# EAGLE schematic STML451RE (EAGLE 9.6.2)

## Sheet 1 of 2
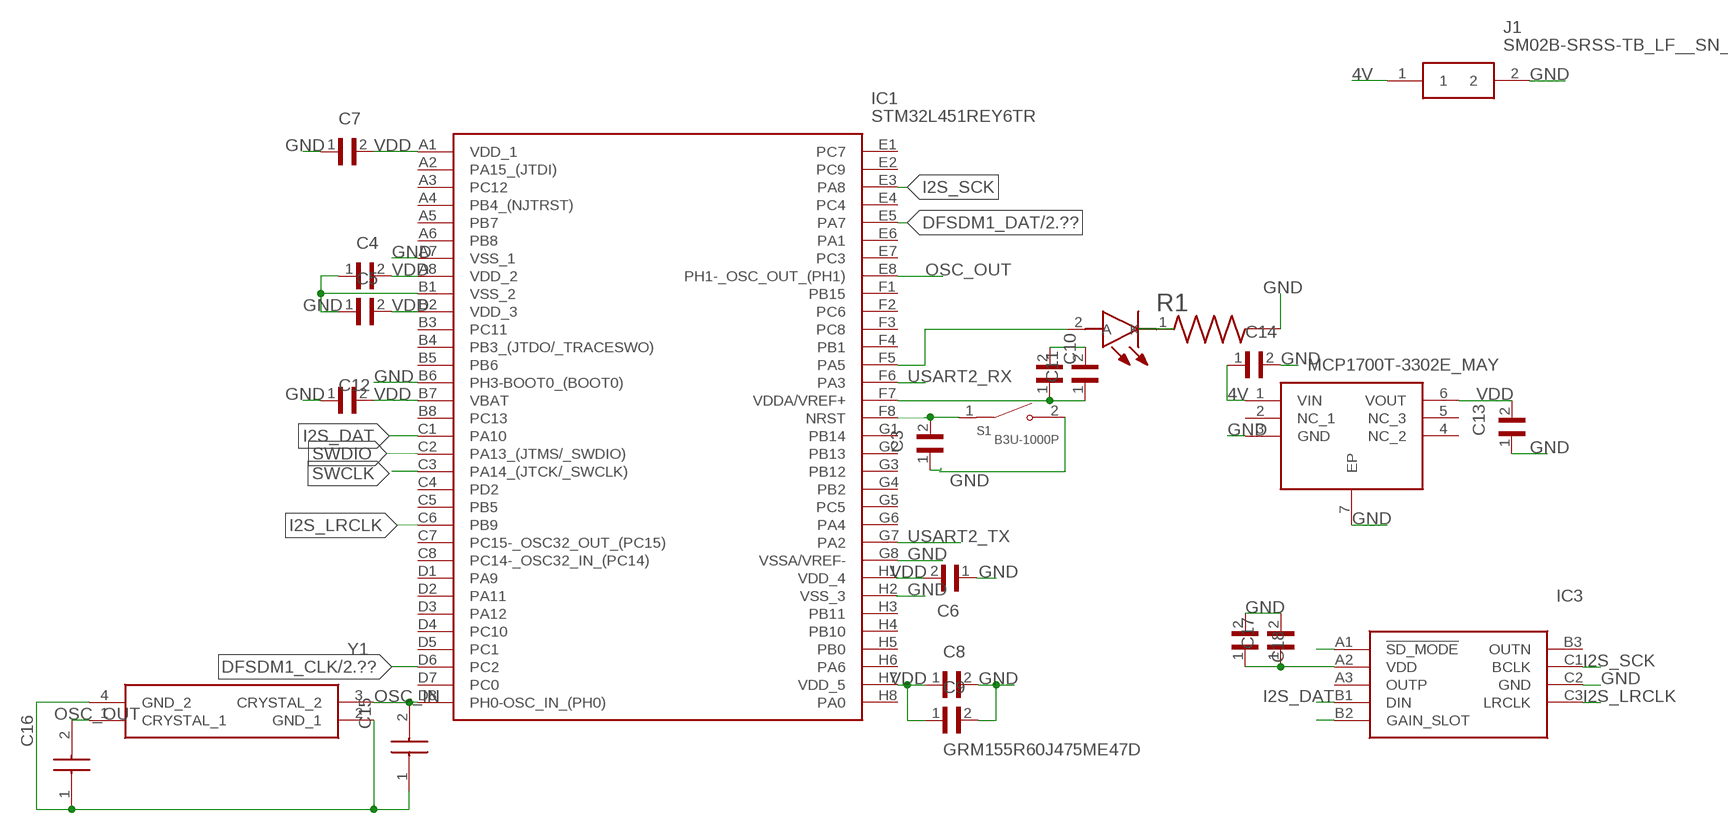
[diagram p0: schematic, sheet 1]

### Parts
C3  GRM033C80J104KE15D  [CAPC0603X33N]
C4  GRM033C80J104KE15D  [CAPC0603X33N]
C5  GRM033C80J104KE15D  [CAPC0603X33N]
C6  GRM033C80J104KE15D  [CAPC0603X33N]
C7  GRM033C80J104KE15D  [CAPC0603X33N]
C8  GRM033C80J104KE15D  [CAPC0603X33N]
C9  GRM155R60J475ME47D  [CAPC1005X60N]
C10  GRM033C80J104KE15D  [CAPC0603X33N]
C11  JMK105C6105KV-F  [CAPC1005X55N]
C12  GRM033C80J104KE15D  [CAPC0603X33N]
C13  JMK105C6105KV-F  [CAPC1005X55N]
C14  JMK105C6105KV-F  [CAPC1005X55N]
C15  0101YA120JAT2A  [CAPC0402X22N]
C16  0101YA120JAT2A  [CAPC0402X22N]
C17  GRM033C80J104KE15D  [CAPC0603X33N]
C18  C0805C106K8PACTU  [CAPC2012X88N]
IC1  STM32L451REY6TR  [BGA64C40P8X8_336X366X58]
IC2  MCP1700T-3302E_MAY  [SON65P200X200X90-7N]
IC3  MAX98357AEWL+T  [BGA9C40P3X3_144X135X69]
J1  SM02B-SRSS-TB_LF__SN_  [SM02B-SRSS-TB]
LED1  VLMS1500-GS08  [VLMG1500GS08]
R1  CRCW02012K20FKED  [RESC0603X28N]
S1  B3U-1000P  [SW_B3U-1000P]
Y1  FL0800008Q  [FL0800008Q]

### Nets
4V: C14.1 IC2.1(VIN) J1.1
DFSDM1_CLK: IC1.D6(PC2) ; also sheet 2
DFSDM1_DAT: IC1.E5(PA7) ; also sheet 2
GND: C3.1 C4.1 C5.1 C6.1 C7.1 C8.2 C9.2 C12.1 C13.1 C14.2 C15.1 C16.1 C17.2 C18.2 IC1.A7(VSS_1) IC1.B1(VSS_2) IC1.B6(PH3-BOOT0_(BOOT0)) IC1.G8(VSSA/VREF-) IC1.H2(VSS_3) IC2.3(GND) IC2.7(EP) IC3.C2(GND) J1.2 R1.2 Y1.2(GND_1) Y1.4(GND_2) ; also sheet 2
I2S_DAT: IC1.C1(PA10) IC3.B1(DIN)
I2S_LRCLK: IC1.C6(PB9) IC3.C3(LRCLK)
I2S_SCK: IC1.E3(PA8) IC3.C1(BCLK)
N$1: IC1.F5(PA5) LED1.2(A)
N$3: IC1.F8(NRST)
N$4: C3.2 S1.1
N$5: S1.2
N$6: C10.1 C11.1 IC1.F7(VDDA/VREF+)
N$7: C10.2 C11.2
N$8: LED1.1(K) R1.1
N$9: C17.1 C18.1 IC3.A2(VDD)
N$13: IC3.B2(GAIN_SLOT)
N$15: IC3.A1(!SD_MODE)
OSC_IN: C15.2 IC1.D8(PH0-OSC_IN_(PH0)) Y1.3(CRYSTAL_2)
OSC_OUT: C16.2 IC1.E8(PH1-_OSC_OUT_(PH1)) Y1.1(CRYSTAL_1)
SWCLK: IC1.C3(PA14_(JTCK/_SWCLK))
SWDIO: IC1.C2(PA13_(JTMS/_SWDIO))
USART2_RX: IC1.F6(PA3)
USART2_TX: IC1.G7(PA2)
VDD: C4.2 C5.2 C6.2 C7.2 C8.1 C9.1 C12.2 C13.2 IC1.A1(VDD_1) IC1.A8(VDD_2) IC1.B2(VDD_3) IC1.B7(VBAT) IC1.H1(VDD_4) IC1.H7(VDD_5) IC2.6(VOUT) ; also sheet 2
Unconnected: IC1.A2(PA15_(JTDI)) IC1.A3(PC12) IC1.A4(PB4_(NJTRST)) IC1.A5(PB7) IC1.A6(PB8) IC1.B3(PC11) IC1.B4(PB3_(JTDO/_TRACESWO)) IC1.B5(PB6) IC1.B8(PC13) IC1.C4(PD2) IC1.C5(PB5) IC1.C7(PC15-_OSC32_OUT_(PC15)) IC1.C8(PC14-_OSC32_IN_(PC14)) IC1.D1(PA9) IC1.D2(PA11) IC1.D3(PA12) IC1.D4(PC10) IC1.D5(PC1) IC1.D7(PC0) IC1.E1(PC7) IC1.E2(PC9) IC1.E4(PC4) IC1.E6(PA1) IC1.E7(PC3) IC1.F1(PB15) IC1.F2(PC6) IC1.F3(PC8) IC1.F4(PB1) IC1.G1(PB14) IC1.G2(PB13) IC1.G3(PB12) IC1.G4(PB2) IC1.G5(PC5) IC1.G6(PA4) IC1.H3(PB11) IC1.H4(PB10) IC1.H5(PB0) IC1.H6(PA6) IC1.H8(PA0) IC2.2(NC_1) IC2.4(NC_2) IC2.5(NC_3) IC3.A3(OUTP) IC3.B3(OUTN)

## Sheet 2 of 2
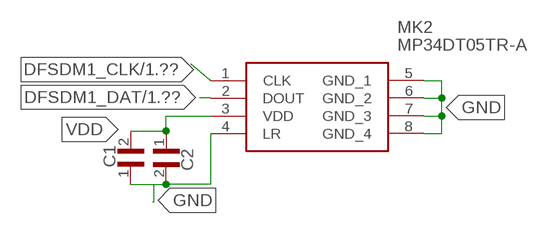
[diagram p1: schematic, sheet 2]

### Parts
C1  GRM033C80J104KE15D  [CAPC0603X33N]
C2  JMK105C6105KV-F  [CAPC1005X55N]
MK2  MP34DT05TR-A  [MP34DT05TRA]

### Nets
DFSDM1_CLK: MK2.1(CLK) ; also sheet 1
DFSDM1_DAT: MK2.2(DOUT) ; also sheet 1
GND: MK2.5(GND_1) MK2.6(GND_2) MK2.7(GND_3) MK2.8(GND_4) ; also sheet 1
N$2: C1.1 C2.2 MK2.4(LR)
VDD: C1.2 C2.1 MK2.3(VDD) ; also sheet 1

## Library data of the parts
C1 C3-C8 C10 C12 C17 = GRM033C80J104KE15D:GRM033C80J104KE15D: .1UF 6.3V 10% 0201; DESCRIPTION: SMD Capacitor X6S(EIA) with Capacitance: 0.10uF Tol. 10%. Rated Voltage: 6.3Vdc; DIGI-KEY_PART_NUMBER: 490-10390-1-ND; DIGIKEY-PURCHASE-URL: https://snapeda.com/shop?store=DigiKey&id=1836969; MF: Murata Electronics; MP: GRM033C80J104KE15D; PACKAGE: 0603 Taiyo Yuden
C2 C11 C13 C14 = JMK105C6105KV-F:JMK105C6105KV-F: CAP CER 1UF 6.3V X6S 0402; DESCRIPTION: 1µF ±10% 6.3V Ceramic Capacitor X6S 0402 (1005 Metric); DIGI-KEY_PART_NUMBER: 587-3381-1-ND; MF: Taiyo Yuden; MP: JMK105C6105KV-F; PACKAGE: 1005 Taiyo Yuden
C9 = GRM155R60J475ME47D:GRM155R60J475ME47D: Cap Ceramic 4.7uF 6.3V X5R 20% Pad SMD 0402 85°C T/R; DESCRIPTION: SMD Capacitor X5R(EIA) with Capacitance: 4.7uF Tol. 20%. Rated Voltage: 6.3Vdc; DIGI-KEY_PART_NUMBER: 490-5915-1-ND; MF: Murata; MP: GRM155R60J475ME47D; PACKAGE: 1005 Taiyo Yuden
C15 C16 = 0101YA120JAT2A:0101YA120JAT2A: Multilayer Ceramic Capacitors MLCC - SMD/SMT 16V 12pF C0G 0101 5% Source: Datasheet <https://componentsearchengine.com/Datasheets/1/0101YA120JAT2A.pdf>; ARROW_PART_NUMBER: 0101YA120JAT2A; DESCRIPTION: Multilayer Ceramic Capacitors MLCC - SMD/SMT 16V 12pF C0G 0101 5%; HEIGHT: 0.22mm; MANUFACTURER_NAME: AVX; MANUFACTURER_PART_NUMBER: 0101YA120JAT2A; MOUSER_PART_NUMBER: 581-0101YA120JAT2A; MOUSER_PRICE-STOCK: https://www.mouser.co.uk/ProductDetail/AVX/0101YA120JAT2A?qs=%2FqkzDQqtunKwlmb2lfYspQ%3D%3D
C18 = C0805C106K8PACTU:C0805C106K8PACTU; DESCRIPTION: 10µF ±10% 10V Ceramic Capacitor X5R 0805 (2012 Metric); MF: KEMET; MP: C0805C106K8PACTU; PACKAGE: 0805 KEMET
IC1 = STM32L451REY6TR:STM32L451REY6TR: ARM Microcontrollers - MCU 16/32-BITS MICROS Source: Datasheet <http://www.st.com/content/ccc/resource/technical/document/datasheet/group3/95/fa/32/09/46/cb/45/35/DM00340475/files/DM00340475.pdf/jcr:content/translations/en.DM00340475.pdf>; DESCRIPTION: ARM Microcontrollers - MCU 16/32-BITS MICROS; HEIGHT: 0.585mm; MANUFACTURER_NAME: STMicroelectronics; MANUFACTURER_PART_NUMBER: STM32L451REY6TR; MOUSER_PART_NUMBER: 511-STM32L451REY6TR; MOUSER_PRICE-STOCK: https://www.mouser.co.uk/ProductDetail/STMicroelectronics/STM32L451REY6TR?qs=Mv7BduZupUg2YTQ5MbUYvA%3D%3D
IC2 = MCP1700T-3302E_MAY:MCP1700T-3302E_MAY: LDO Regulator Pos 3.3V 0.25A Automotive 6-Pin DFN EP T/R Source: Datasheet <http://ww1.microchip.com/downloads/en/DeviceDoc/20001826D.pdf>; ARROW_PART_NUMBER: MCP1700T-3302E/MAY; ARROW_PRICE-STOCK: https://www.arrow.com/en/products/mcp1700t-3302emay/microchip-technology; DESCRIPTION: LDO Regulator Pos 3.3V 0.25A Automotive 6-Pin DFN EP T/R; HEIGHT: 0.9mm; MANUFACTURER_NAME: Microchip; MANUFACTURER_PART_NUMBER: MCP1700T-3302E/MAY; MOUSER_PART_NUMBER: 579-MCP1700T3302EMAY; MOUSER_PRICE-STOCK: https://www.mouser.co.uk/ProductDetail/Microchip-Technology/MCP1700T-3302E-MAY?qs=98WN%2FnWUQiT%252B8kkJEG8McA%3D%3D
IC3 = MAX98357AEWL+T:MAX98357AEWL+T: Audio Amplifiers MAX98357AEWL+T Source: Datasheet <https://datasheets.maximintegrated.com/en/ds/MAX98357A-MAX98357B.pdf>; ARROW_PART_NUMBER: MAX98357AEWL+T; DESCRIPTION: Audio Amplifiers MAX98357AEWL+T; HEIGHT: 0.69mm; MANUFACTURER_NAME: Maxim Integrated; MANUFACTURER_PART_NUMBER: MAX98357AEWL+T; MOUSER_PART_NUMBER: 700-MAX98357AEWL+T; MOUSER_PRICE-STOCK: https://www.mouser.co.uk/ProductDetail/Maxim-Integrated/MAX98357AEWL%2bT?qs=ZrtEiRxEuI4mjqOyZP4d0A%3D%3D
J1 = SM02B-SRSS-TB_LF__SN_:SM02B-SRSS-TB_LF__SN_: CONN HEADER SH 2POS SIDE 1MM TIN Source: Datasheet <http://www.jst-mfg.com/product/pdf/eng/eSH.pdf>; ARROW_PART_NUMBER: SM02B-SRSS-TB(LF)(SN); ARROW_PRICE-STOCK: https://www.arrow.com/en/products/sm02b-srss-tb-lf-sn/jst-manufacturing; DESCRIPTION: CONN HEADER SH 2POS SIDE 1MM TIN; HEIGHT: mm; MANUFACTURER_NAME: JST (JAPAN SOLDERLESS TERMINALS); MANUFACTURER_PART_NUMBER: SM02B-SRSS-TB(LF)(SN)
LED1 = VLMS1500-GS08:VLMS1500-GS08: Vishay 631 nm Red LED, 1005 (0402) SMD package Source: Datasheet <https://componentsearchengine.com/Datasheets/2/VLMS1500-GS08.pdf>; ARROW_PART_NUMBER: VLMS1500-GS08; ARROW_PRICE-STOCK: https://www.arrow.com/en/products/vlms1500-gs08/vishay; DESCRIPTION: Vishay 631 nm Red LED, 1005 (0402) SMD package; HEIGHT: mm; MANUFACTURER_NAME: Vishay; MANUFACTURER_PART_NUMBER: VLMS1500-GS08; MOUSER_PART_NUMBER: 78-VLMS1500-GS08; MOUSER_PRICE-STOCK: https://www.mouser.co.uk/ProductDetail/Vishay-Semiconductors/VLMS1500-GS08?qs=2BArZ0I3QllOybMBfd%252BobQ%3D%3D
MK2 = MP34DT05TR-A:MP34DT05TR-A: STMICROELECTRONICS - MP34DT05TR-A - MEMS MICROPHONE, 3.6V, HCLGA-4 Source: Datasheet <http://www.st.com/content/ccc/resource/technical/document/datasheet/group3/c7/90/d3/f6/b7/e7/40/c8/DM00415595/files/DM00415595.pdf/jcr:content/translations/en.DM00415595.pdf>; DESCRIPTION: STMICROELECTRONICS - MP34DT05TR-A - MEMS MICROPHONE, 3.6V, HCLGA-4; HEIGHT: 1mm; MANUFACTURER_NAME: STMicroelectronics; MANUFACTURER_PART_NUMBER: MP34DT05TR-A; MOUSER_PART_NUMBER: 511-MP34DT05TR-A; MOUSER_PRICE-STOCK: https://www.mouser.com/Search/Refine.aspx?Keyword=511-MP34DT05TR-A
R1 = CRCW02012K20FKED:CRCW02012K20FKED; DESCRIPTION: 2.2 kOhms ±1% 0.05W, 1/20W Chip Resistor 0201 (0603 Metric) Thick Film; DIGI-KEY_PART_NUMBER: 541-2.20KAABCT-ND; DIGIKEY-PURCHASE-URL: https://snapeda.com/shop?store=DigiKey&id=4092052; MF: Vishay; MP: CRCW02012K20FKED; PACKAGE: 0603 Vishay
S1 = B3U-1000P:B3U-1000P: Switch Tactile N.O. SPST Round Button Gull Wing 0.05A 12VDC 1.5N SMD Embossed T/R; DESCRIPTION: Tactile Switch SPST-NO Top Actuated Surface Mount; DIGI-KEY_PART_NUMBER: SW1020CT-ND; DIGIKEY-PURCHASE-URL: https://snapeda.com/shop?store=DigiKey&id=104326; MF: Omron; MP: B3U-1000P; PACKAGE: None
Y1 = FL0800008Q:FL0800008Q: Crystals Crystal Ceramic Source: Datasheet; DESCRIPTION: Crystals Crystal Ceramic; HEIGHT: 0.78mm; MANUFACTURER_NAME: Diodes Inc.; MANUFACTURER_PART_NUMBER: FL0800008Q; MOUSER_PART_NUMBER: 729-FL0800008Q; MOUSER_PRICE-STOCK: https://www.mouser.co.uk/ProductDetail/Diodes-Incorporated/FL0800008Q?qs=gZXFycFWdAO7SZw%2FmZY3pg%3D%3D